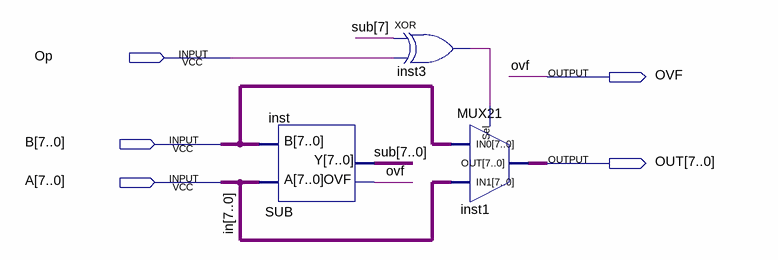
[diagram p0: schematic sheet]
// Quartus schematic MINMAX.bdf as structural Verilog: 3 symbols, 5 pins
module MINMAX (
  input  Op,
  input  [7:0] B,
  input  [7:0] A,
  output OVF,
  output [7:0] OUT
);

  wire inst3_out;
  wire [7:0] sub;

  SUB inst (.A(A), .B(B), .OVF(OVF), .Y(sub));
  xor inst3 (inst3_out, sub[7], Op);
  MUX21 inst1 (.Sel(inst3_out), .IN0(B), .IN1(A), .OUT(OUT));

  // Other names for the same wires on the sheet: in[7:0] = A
endmodule
